# Altium schematic sheet thread.SchDoc
size A4
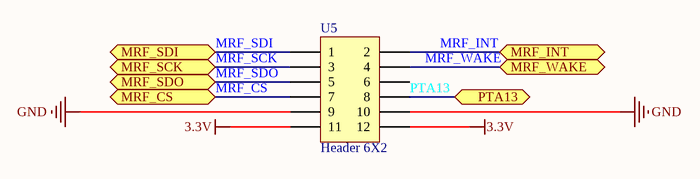
[diagram p0: thread.SchDoc]

## Parts
U5  Header 6X2  [HDR2X6]

## Ports
MRF_CS, MRF_INT, MRF_SCK, MRF_SDI, MRF_SDO, MRF_WAKE, PTA13

## Nets
3.3V: U5.11 U5.12
GND: U5.9 U5.10
MRF_CS: U5.7 ; port MRF_CS
MRF_INT: U5.2 ; port MRF_INT
MRF_SCK: U5.3 ; port MRF_SCK
MRF_SDI: U5.1 ; port MRF_SDI
MRF_SDO: U5.5 ; port MRF_SDO
MRF_WAKE: U5.4 ; port MRF_WAKE
PTA13: U5.8 ; port PTA13

Not connected (* = marked no-connect by the designer): U5 6

## Library data of the parts
U5 = Header 6X2: Header, 6-Pin, Dual row; LatestRevisionDate: 17-Jul-2002; LatestRevisionNote: Re-released for DXP Platform.; Publisher: Altium Limited